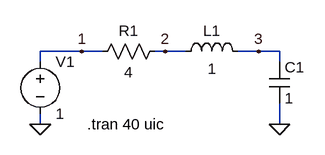
[diagram p0: schematic V_RLC_Test-411.asc]
V_RLC_Test-411.asc, the LTspice schematic file:
Version 4
SHEET 1 880 680
WIRE 64 128 0 128
WIRE 96 128 64 128
WIRE 192 128 176 128
WIRE 224 128 192 128
WIRE 336 128 304 128
WIRE 368 128 336 128
WIRE 0 144 0 128
WIRE 368 144 368 128
WIRE 0 240 0 224
WIRE 368 240 368 208
FLAG 368 240 0
FLAG 0 240 0
FLAG 64 128 1
FLAG 192 128 2
FLAG 336 128 3
SYMBOL res 80 144 R270
WINDOW 0 32 56 VTop 2
WINDOW 3 0 56 VBottom 2
SYMATTR InstName R1
SYMATTR Value 4
SYMBOL ind 208 144 R270
WINDOW 0 32 56 VTop 2
WINDOW 3 5 56 VBottom 2
SYMATTR InstName L1
SYMATTR Value 1
SYMBOL cap 352 144 R0
SYMATTR InstName C1
SYMATTR Value 1
SYMBOL voltage 0 128 R0
WINDOW 123 0 0 Left 2
WINDOW 39 0 0 Left 2
SYMATTR InstName V1
SYMATTR Value 1
TEXT 72 240 Left 2 !.tran 40 uic

The netlist it stands for:
* V_RLC_Test-411.asc
R1 1 2 4
L1 2 3 1
C1 3 0 1
V1 1 0 1
.tran 40 uic
.backanno
.end